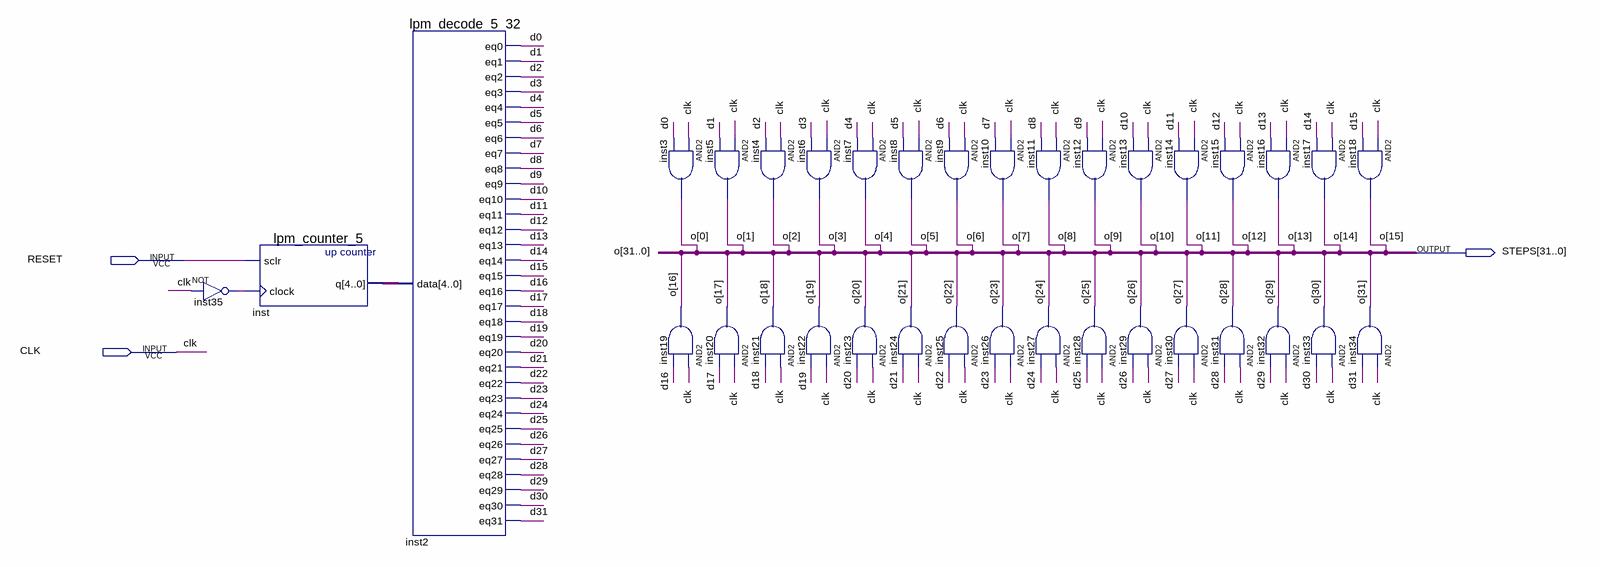
[diagram p0: schematic sheet]
// Quartus schematic stairway.bdf as structural Verilog: 35 symbols, 3 pins
module stairway (
  input  RESET,
  input  CLK,
  output [31:0] STEPS
);

  wire d0, d1, d2, d3, d4, d5, d6, d7, d8, d9, d10, d11, d12, d13, d14, d15, d16, d17, d18, d19, d20, d21,
       d22, d23, d24, d25, d26, d27, d28, d29, d30, d31, inst35_out;
  wire [4:0] inst_q;

  not inst35 (inst35_out, CLK);
  lpm_counter_5 inst (.sclr(RESET), .clock(inst35_out), .q(inst_q));
  lpm_decode_5_32 inst2 (
    .data(inst_q), .eq0(d0), .eq1(d1), .eq2(d2), .eq3(d3), .eq4(d4), .eq5(d5), .eq6(d6), .eq7(d7), .eq8(d8),
    .eq9(d9), .eq10(d10), .eq11(d11), .eq12(d12), .eq13(d13), .eq14(d14), .eq15(d15), .eq16(d16), .eq17(d17),
    .eq18(d18), .eq19(d19), .eq20(d20), .eq21(d21), .eq22(d22), .eq23(d23), .eq24(d24), .eq25(d25),
    .eq26(d26), .eq27(d27), .eq28(d28), .eq29(d29), .eq30(d30), .eq31(d31));
  and inst3 (STEPS[0], CLK, d0);
  and inst5 (STEPS[1], CLK, d1);
  and inst19 (STEPS[16], CLK, d16);
  and inst20 (STEPS[17], CLK, d17);
  and inst4 (STEPS[2], CLK, d2);
  and inst21 (STEPS[18], CLK, d18);
  and inst6 (STEPS[3], CLK, d3);
  and inst22 (STEPS[19], CLK, d19);
  and inst7 (STEPS[4], CLK, d4);
  and inst8 (STEPS[5], CLK, d5);
  and inst23 (STEPS[20], CLK, d20);
  and inst24 (STEPS[21], CLK, d21);
  and inst9 (STEPS[6], CLK, d6);
  and inst25 (STEPS[22], CLK, d22);
  and inst10 (STEPS[7], CLK, d7);
  and inst26 (STEPS[23], CLK, d23);
  and inst11 (STEPS[8], CLK, d8);
  and inst12 (STEPS[9], CLK, d9);
  and inst27 (STEPS[24], CLK, d24);
  and inst28 (STEPS[25], CLK, d25);
  and inst13 (STEPS[10], CLK, d10);
  and inst29 (STEPS[26], CLK, d26);
  and inst14 (STEPS[11], CLK, d11);
  and inst30 (STEPS[27], CLK, d27);
  and inst15 (STEPS[12], CLK, d12);
  and inst16 (STEPS[13], CLK, d13);
  and inst31 (STEPS[28], CLK, d28);
  and inst32 (STEPS[29], CLK, d29);
  and inst17 (STEPS[14], CLK, d14);
  and inst33 (STEPS[30], CLK, d30);
  and inst18 (STEPS[15], CLK, d15);
  and inst34 (STEPS[31], CLK, d31);

  // Other names for the same wires on the sheet: o[31:0] = STEPS
endmodule
